# EAGLE design spad-wirebonding-board (EAGLE 9.3.2)
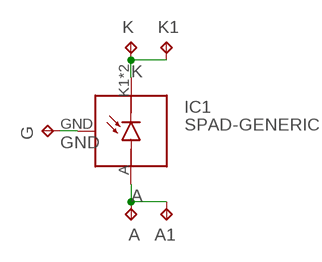
[diagram p0: schematic, sheet 1]

## Parts
A  TPTP10R  [TP10R]
A1  TPTP10R  [TP10R]
G  TPTP10R  [TP10R]
IC1  SPAD-GENERIC  [SPAD-WIREBOND-GENERIC-CRYO]
K  TPTP10R  [TP10R]
K1  TPTP10R  [TP10R]

## Nets
A: A1.TP A.TP IC1.A(SPAD_ANODE)
GND: G.TP IC1.GND
K: IC1.K1(SPAD_CATHODE) IC1.K2(SPAD_CATHODE) K1.TP K.TP

## Library data of the parts
A A1 G K K1 = testpad:TP: Test pad
IC1 = meng:SPAD-GENERIC

## Board
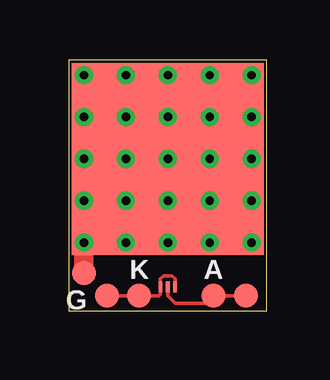
[diagram p1: board, top side]
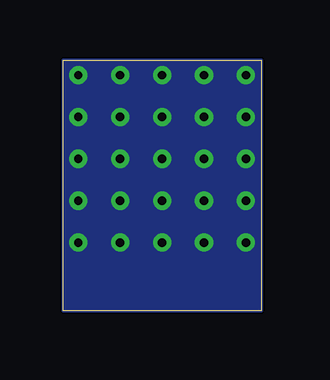
[diagram p2: board, bottom side, seen from below]

Size 8.26 x 10.48 mm. Coordinates in mm from the lower left corner, seen from the top.
Outline: 0,0 8.26,0 8.26,10.48 0,10.48 0,0
Copper layers (1*16): Top 0.035mm / dielectric 1.5mm / Bottom 0.035mm
Design rules "default *": minimum track width 6mil, minimum drill 0.35mm, track to track 6mil, track to pad 6mil, pad to pad 6mil, via to via 6mil, smd to smd 6mil, copper to edge 0mil, drill to drill 6mil, minimum pad ring 10mil, minimum via ring 8mil, stop-mask expansion 4mil, vias tented up to drill 0mil, thermal gap 10mil

### Footprints (pad centres in the part's own frame; a part is rotated, then mirrored left to right if it is on the bottom)
TP10R = smd 1 x 1: TP 0,0
SPAD-WIREBOND-GENERIC-CRYO = smd 0.152 x 0.457: A 0,-5.334; K1 -0.305,-5.334; K2 0.305,-5.334 | smd 8 x 8: GND 0,0

### Placement (x,y rotation side)
A  6.03,0.64 0 top
A1  7.38,0.64 0 top
G  0.64,1.59 0 top
IC1  4.13,6.35 0 top
K  2.94,0.64 0 top
K1  1.59,0.64 0 top

### Tracks (layer width: path | path; a pad name or v marks a point on that pad's centre or on a via)
A
  Top 0.152: IC1.A 4.13,0.64 4.45,0.32 5.71,0.32 A.TP A1.TP
GND  (via drill 0.35)
  Top 0.813: G.TP v0.64,2.86 IC1.GND
  other vias: 4.13,6.35 0.64,6.35 7.62,6.35 4.13,9.84 4.13,2.86 7.62,2.86 0.64,9.84 7.62,9.84 5.87,9.84 2.38,9.84 4.13,8.1 0.64,8.1 0.64,4.6 2.38,2.86 5.87,2.86 7.62,4.6 7.62,8.1 4.13,4.6 5.87,4.6 5.87,6.35 5.87,8.1 2.38,8.1 2.38,6.35 2.38,4.6
  pour Bottom: 0,10.48 8.26,10.48 8.26,0 0,0
K
  Top 0.152: IC1.K2 4.43,1.34 4.3,1.47 3.96,1.47 3.82,1.34 IC1.K1 3.82,0.7 3.76,0.64 K.TP K1.TP